# Altium schematic sheet PowerBoard.SchDoc
size A4
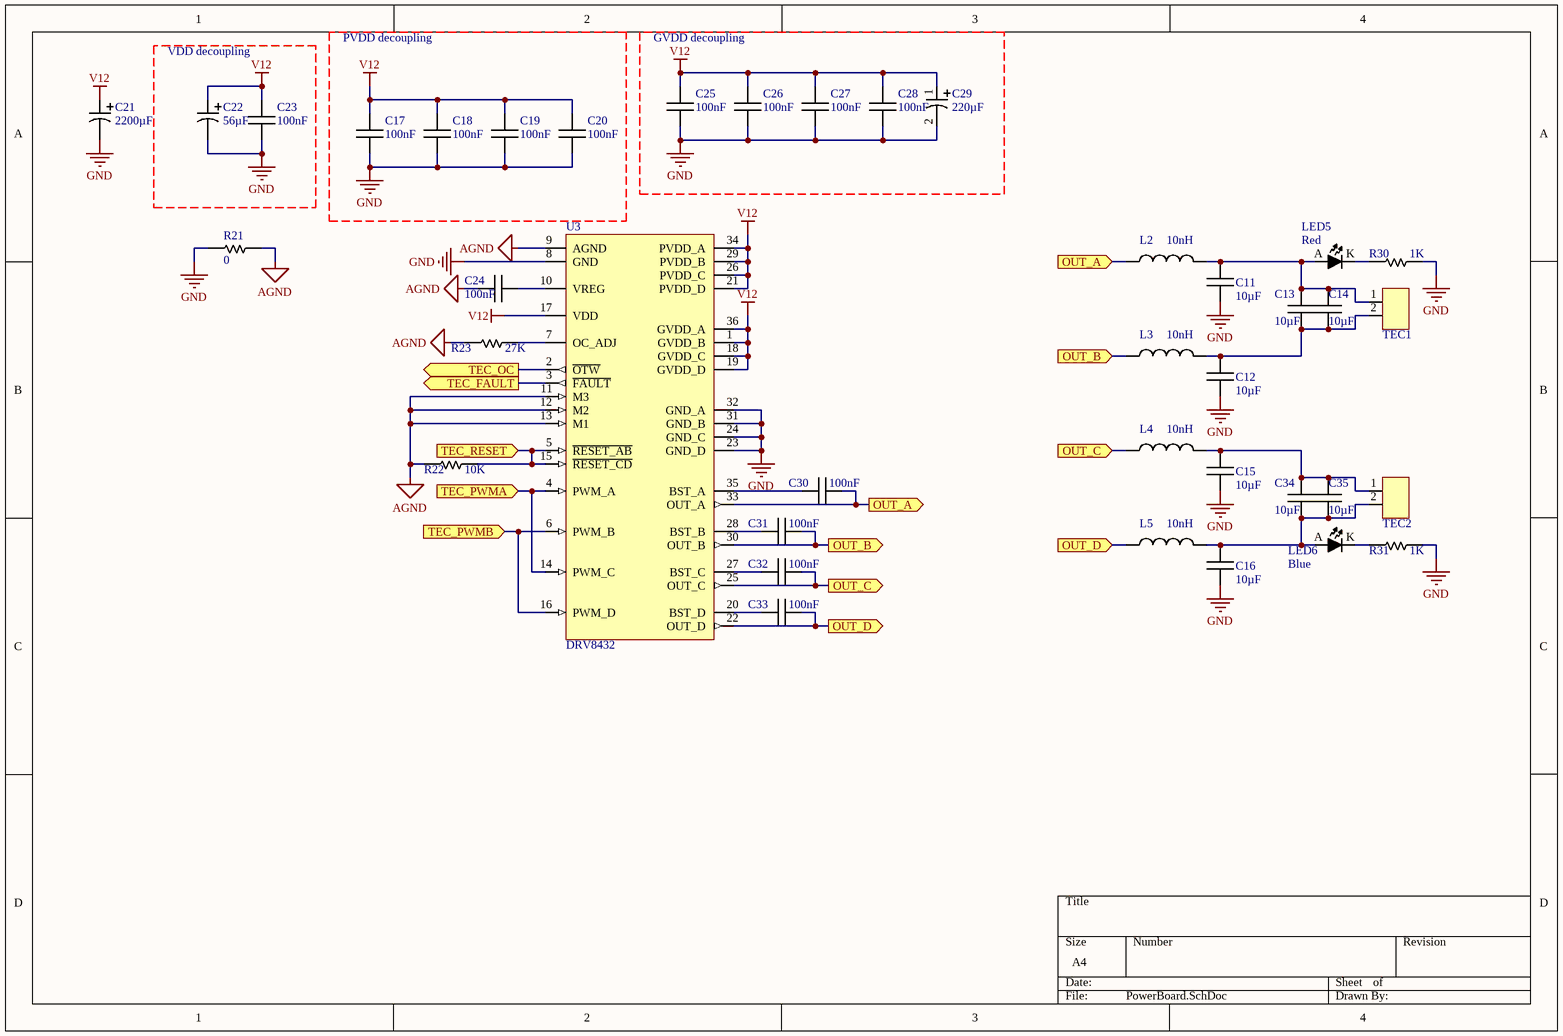
[diagram p0: PowerBoard.SchDoc]

## Parts
C11  10µF  [CAPC3225N]
C12  10µF  [CAPC3225N]
C13  10µF  [CAPC3225N]
C14  10µF  [CAPC3225N]
C15  10µF  [CAPC3225N]
C16  10µF  [CAPC3225N]
C17  100nF  [CAPC1608N]
C18  100nF  [CAPC1608N]
C19  100nF  [CAPC1608N]
C20  100nF  [CAPC1608N]
C21  2200µF  [CAPPR7.5-18x35.5]
C22  56µF  [CAPPR2.5-6.3x15]
C23  100nF  [CAPC1608N]
C24  100nF  [CAPC1608N]
C25  100nF  [CAPC1608N]
C26  100nF  [CAPC1608N]
C27  100nF  [CAPC1608N]
C28  100nF  [CAPC1608N]
C29  220µF  [CAPPR3.5-8x15]
C30  100nF  [CAPC1608N]
C31  100nF  [CAPC1608N]
C32  100nF  [CAPC1608N]
C33  100nF  [CAPC1608N]
C34  10µF  [CAPC3225N]
C35  10µF  [CAPC3225N]
L2  10nH  [Inductor 9.1×7.6mm TH]
L3  10nH  [Inductor 9.1×7.6mm TH]
L4  10nH  [Inductor 9.1×7.6mm TH]
L5  10nH  [Inductor 9.1×7.6mm TH]
LED5  Red  [LED 1608m]
LED6  Blue  [LED 1608m]
R21  0  [RESC1608N]
R22  10K  [RESC1608N]
R23  27K  [RESC2012N]
R30  1K  [RESC1608N]
R31  1K  [RESC1608N]
TEC1  High-Power Connector 2p  [High-Power Connector 2]  (value not drawn)
TEC2  High-Power Connector 2p  [High-Power Connector 2]  (value not drawn)
U3  DRV8432  [PSOP3-36]

## Ports
OUT_A (in), OUT_A (out), OUT_B (in), OUT_B (out), OUT_C (in), OUT_C (out), OUT_D (in), OUT_D (out), TEC_FAULT (out), TEC_OC (out), TEC_PWMA (in), TEC_PWMB (in), TEC_RESET (in)

## Nets
AGND: C24.2 R21.2 R22.1 R23.1 U3.9(AGND) U3.11(M3) U3.12(M2) U3.13(M1)
GND: C11.1 C12.1 C15.1 C16.1 C17.1 C18.1 C19.1 C20.1 C21.2 C22.2 C23.1 C25.1 C26.1 C27.1 C28.1 C29.2 R21.1 R30.2 R31.2 U3.8(GND) U3.23(GND_D) U3.24(GND_C) U3.31(GND_B) U3.32(GND_A)
V12: C17.2 C18.2 C19.2 C20.2 C21.1 C22.1 C23.2 C25.2 C26.2 C27.2 C28.2 C29.1 U3.1(GVDD_B) U3.17(VDD) U3.18(GVDD_C) U3.19(GVDD_D) U3.21(PVDD_D) U3.26(PVDD_C) U3.29(PVDD_B) U3.34(PVDD_A) U3.36(GVDD_A)
OUT_A: C30.2 L2.1 U3.33(OUT_A) ; port OUT_A
OUT_B: C31.2 L3.1 U3.30(OUT_B) ; port OUT_B
OUT_C: C32.2 L4.1 U3.25(OUT_C) ; port OUT_C
OUT_D: C33.2 L5.1 U3.22(OUT_D) ; port OUT_D
TEC_FAULT: U3.3(~{FAULT}) ; port TEC_FAULT
TEC_OC: U3.2(~{OTW}) ; port TEC_OC
TEC_PWMA: U3.4(PWM_A) U3.14(PWM_C) ; port TEC_PWMA
TEC_PWMB: U3.6(PWM_B) U3.16(PWM_D) ; port TEC_PWMB
TEC_RESET: R22.2 U3.5(~{RESET_AB}) U3.15(~{RESET_CD}) ; port TEC_RESET
NetC11_2: C11.2 C13.2 C14.2 L2.2 LED5.A TEC1.1
NetC12_2: C12.2 C13.1 C14.1 L3.2 TEC1.2
NetC15_2: C15.2 C34.2 C35.2 L4.2 TEC2.1
NetC16_2: C16.2 C34.1 C35.1 L5.2 LED6.A TEC2.2
NetC24_1: C24.1 U3.10(VREG)
NetC30_1: C30.1 U3.35(BST_A)
NetC31_1: C31.1 U3.28(BST_B)
NetC32_1: C32.1 U3.27(BST_C)
NetC33_1: C33.1 U3.20(BST_D)
NetLED5_K: LED5.K R30.1
NetLED6_K: LED6.K R31.1
NetR23_2: R23.2 U3.7(OC_ADJ)

## Notes on the sheet
- PVDD decoupling
- GVDD decoupling
- VDD decoupling

## Library data of the parts
C11-C20 C23-C28 C30-C35 = Capacitor
  C11-C16 C34 C35: Value: 10µF
  C17-C20 C23-C28 C30-C33: Value: 100nF
C21 C22 = Capacitor Polarised: Voltage Rating: 25V
  C21: Value: 2200µF
  C22: Value: 56µF
C29 = Capacitor Polarised: Voltage rating: 25V; Value: 220µF
L2-L5 = Inductor: Value: 10nH
LED5 LED6 = LED: pin to pad: A>1 K>2
  LED5: Color: Red
  LED6: Color: Blue
R21-R23 R30 R31 = Resistor
  R21: Value: 0
  R22: Value: 10K
  R23: Value: 27K
  R30 R31: Value: 1K